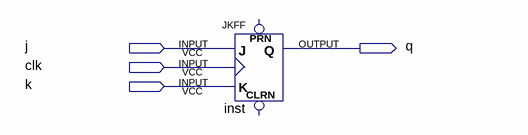
[diagram p0: schematic sheet]
// Quartus schematic p4_jkff.bdf as structural Verilog: 1 symbols, 4 pins
module p4_jkff (
  input  j,
  input  clk,
  input  k,
  output q
);

  JKFF inst (.K(k), .J(j), .CLK(clk), .Q(q));  // open: PRN, CLRN
endmodule
